# Altium schematic sheet NB_IoT.SchDoc
size A4
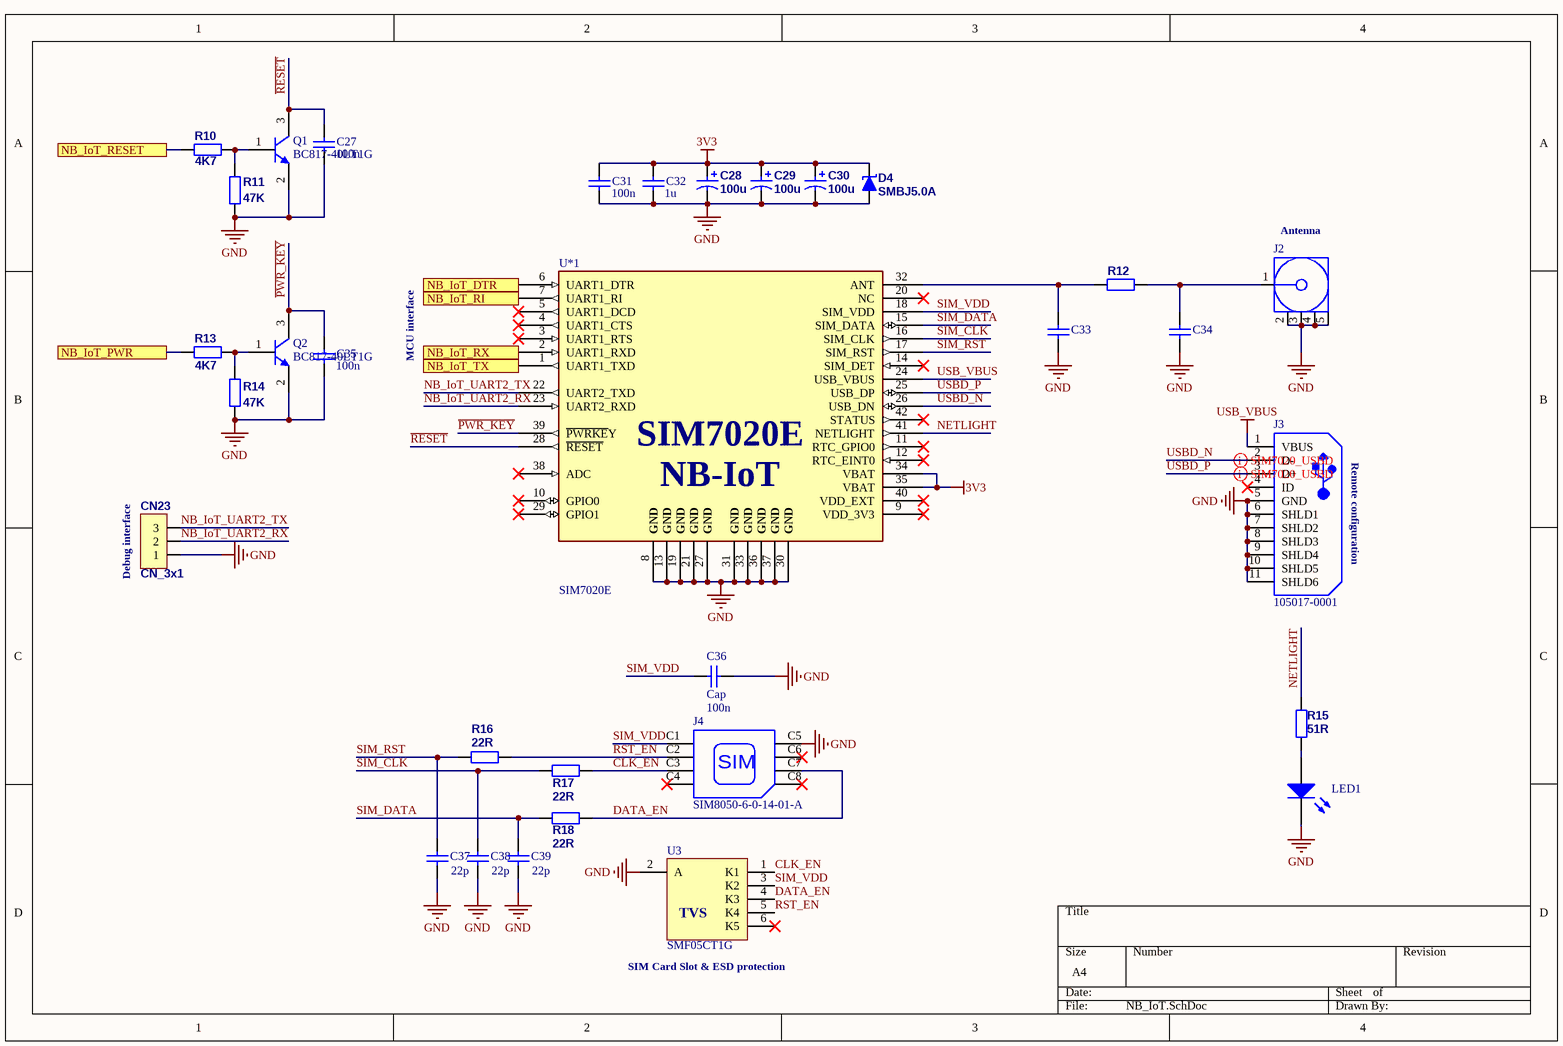
[diagram p0: NB_IoT.SchDoc]

## Parts
C27  value 100n  [0603_CAP_NPOL]  (hidden comment: Cap)
C28  100u  [0603_CAP_NPOL]
C29  100u  [0603_CAP_NPOL]
C30  100u  [0603_CAP_NPOL]
C31  value 100n  [0603_CAP_NPOL]  (hidden comment: Cap)
C32  value 1u  [0603_CAP_NPOL]  (hidden comment: Cap)
C33  ap  [0603_CAP_NPOL]  (value not drawn)
C34  ap  [0603_CAP_NPOL]  (value not drawn)
C35  value 100n  [0603_CAP_NPOL]  (hidden comment: Cap)
C36  Cap  value 100n  [0603_CAP_NPOL]
C37  value 22p  [0603_CAP_NPOL]  (hidden comment: Cap)
C38  value 22p  [0603_CAP_NPOL]  (hidden comment: Cap)
C39  value 22p  [0603_CAP_NPOL]  (hidden comment: Cap)
CN23  CN_3x1  [GP_3x1_2mm]
D4  SMBJ5.0A  [SMB]
J2  731000114  [MOLX-731000114_V]  (value not drawn)
J3  105017-0001  [USB-MICRO-B_V]
J4  SIM8050-6-0-14-01-A  [GCT-SIM8050-6_V]
LED1  150080RS75000  [0805_A]  (value not drawn)
Q1  BC817-40LT1G  [ONSC-SOT-23-3-318-08_V]
Q2  BC817-40LT1G  [ONSC-SOT-23-3-318-08_V]
R10  4K7  [0402_RES]
R11  47K  [0402_RES]
R12  (no value)  [0402_RES]
R13  4K7  [0402_RES]
R14  47K  [0402_RES]
R15  51R  [0402_RES]
R16  22R  [0402_RES]
R17  22R  [0402_RES]
R18  22R  [0402_RES]
U3  SMF05CT1G  [ONSC-SC70-6-419B-02_W_V]
U*1  SIM7020E  [LCC_42PIN]

## Ports
NB_IoT_DTR, NB_IoT_PWR, NB_IoT_RESET, NB_IoT_RI, NB_IoT_RX, NB_IoT_TX

## Nets
3V3: C28.1 C29.1 C30.1 C31.2 C32.2 D4.2(K) U*1.34(VBAT) U*1.35(VBAT)
GND: C27.1 C28.2 C29.2 C30.2 C31.1 C32.1 C33.1 C34.1 C35.1 C36.2 C37.1 C38.1 C39.1 CN23.1 D4.1(A) J2.2 J2.3 J2.4 J2.5 J3.5(GND) J3.6(SHLD1) J3.7(SHLD2) J3.8(SHLD3) J3.9(SHLD4) J3.10(SHLD5) J3.11(SHLD6) J4.C5(GND) LED1.1(K) Q1.2(E) Q2.2(E) R11.1 R14.1 U3.2(A) U*1.8(GND) U*1.13(GND) U*1.19(GND) U*1.21(GND) U*1.27(GND) U*1.30(GND) U*1.31(GND) U*1.33(GND) U*1.36(GND) U*1.37(GND)
USB_VBUS: J3.1(VBUS) U*1.24(USB_VBUS)
~{PWR_KEY}: C35.2 Q2.3(C) U*1.39(~{PWRKE}Y)
~{RESET}: C27.2 Q1.3(C) U*1.28(~{RESET})
CLK_EN: J4.C3(CLK) R17.2 U3.1(K1)
DATA_EN: J4.C7(I/O) R18.2 U3.4(K3)
NB_IoT_DTR: U*1.6(UART1_DTR) ; port NB_IoT_DTR
NB_IoT_PWR: R13.1 ; port NB_IoT_PWR
NB_IoT_RESET: R10.1 ; port NB_IoT_RESET
NB_IoT_RI: U*1.7(UART1_RI) ; port NB_IoT_RI
NB_IoT_RX: U*1.2(UART1_RXD) ; port NB_IoT_RX
NB_IoT_TX: U*1.1(UART1_TXD) ; port NB_IoT_TX
NB_IoT_UART2_RX: CN23.2 U*1.23(UART2_RXD)
NB_IoT_UART2_TX: CN23.3 U*1.22(UART2_TXD)
NETLIGHT: R15.2 U*1.41(NETLIGHT)
RST_EN: J4.C2(RST) R16.2 U3.5(K4)
SIM_CLK: C38.2 R17.1 U*1.16(SIM_CLK)
SIM_DATA: C39.2 R18.1 U*1.15(SIM_DATA)
SIM_RST: C37.2 R16.1 U*1.17(SIM_RST)
SIM_VDD: C36.1 J4.C1(VCC) U3.3(K2) U*1.18(SIM_VDD)
USBD_N: J3.2(D-) U*1.26(USB_DN)
USBD_P: J3.3(D+) U*1.25(USB_DP)
NetC33_2: C33.2 R12.1 U*1.32(ANT)
NetC34_2: C34.2 J2.1 R12.2
NetLED1_2: LED1.2(A) R15.1
NetQ1_1: Q1.1(B) R10.2 R11.2
NetQ2_1: Q2.1(B) R13.2 R14.2

Not connected (* = marked no-connect by the designer): J3 4(ID)*; J4 C4(SHLD)* C6(VPP)* C8(SHLD)*; U3 6(K5)*; U*1 3(UART1_RTS)* 4(UART1_CTS)* 5(UART1_DCD)* 9(VDD_3V3)* 10(GPIO0)* 11(RTC_GPIO0)* 12(RTC_EINT0)* 14(SIM_DET)* 20(NC)* 29(GPIO1)* 38(ADC)* 40(VDD_EXT)* 42(STATUS)*

## Layout directives
differential pair: USBD_N, USBD_P

## Notes on the sheet
- (near J2) Antenna
- MCU interface
- Remote configuration
- (near CN23) Debug interface
- (near U3) TVS
- (near U3) SIM Card Slot & ESD protection
- (in symbol CMP-2000-07068-1) SIM
- (in symbol SIM7020E) NB-IoT

## Library data of the parts
C27 C31-C39 = Cap: Capacitor; Published: 8-Jun-2000; LatestRevisionDate: 17-Jul-2002; LatestRevisionNote: Re-released for DXP Platform.; PackageReference: RAD-0.3; Publisher: Altium Limited; PackageDescription: Radial Cap, Thru-Hole; 2 Leads; 0.3 in Pin Spacing
C28-C30 = Cap Pol: Polarized Capacitor; ComponentLink1Description: datasheet; ComponentLink2Description: supplier; Value: 100u
D4 = SMBJ5.0A: 5.0V, 600W Surface Mount Transient Voltage Suppression Diode, SMBJ Series; Supplier 1: Farnell; Supplier 2: Farnell; Supplier 3: Farnell; Supplier 4: Farnell; Supplier 5: Farnell; Supplier 6: Farnell; Supplier 7: Farnell; Supplier 8: Farnell; Supplier 9: Farnell; Supplier 10: Farnell; Supplier 11: TME; Supplier 12: TME; Supplier 13: TME; Supplier Part Number 1: 9381554; Supplier Part Number 2: 1797897; Supplier Part Number 3: 9886311; Supplier Part Number 4: 2097845; Supplier Part Number 5: 1456972; Supplier Part Number 6: 7277792; Supplier Part Number 7: 9551107; Supplier Part Number 8: 2429079; Supplier Part Number 9: 2353654; Supplier Part Number 10: 2252493; Supplier Part Number 11: SMBJ5.0A-E3/52; Supplier Part Number 12: SMBJ5.0A-LF; Supplier Part Number 13: SMBJ5.0A-TR
J2 = CMP-2000-05487-1: SMA Right-Angle PCB Jack Receptacle, Brass Body, Gold Plated, 50 Ohm, 5-Pin THD, RoHS, Tray; Manufacturer: Molex; Datasheet Version: 09/2016; Package Description: 5-Pin Through Hole Device, Body 14.8 x 6.35 mm, Pitch 2.54 mm; Datasheet URL: http://www.molex.com/webdocs/datasheets/pdf/en-us/0731000114_RF_COAX_CONNECTORS.pdf; Manufacturer URL: http://www.molex.com/; Package Reference: 731000114; Mounting Technology: ThroughHole; Package URL: http://www.molex.com/pdm_docs/sd/731000114_sd.pdf
J3 = CMP-2000-05827-1: Micro-USB B Receptacle, Right Angle, Bottom Mount, Surface Mount, with Solder Tabs, -30 to 85 degC, 5-Pin USB, RoHS, Tape and Reel; Manufacturer: Molex; Featured Product: Micro-USBConnectorsUSBConnectors; Other Names: WM1399DKR; Package Version: Rev. F, 12/2012; Number of Contacts: 5; Connector Type: USB-microB; Catalog Drawings: 1050170001; 3D Model: 105017-0001.stp; Mating Products: WM17145-ND-CABLEMICROUSBBTOSTDA1.0MWM17147-ND-CABLEMICROUSBBTOSTDA2.0MWM17146-ND-CABLEMICROUSBBTOSTDA1.5M; PCN Assembly/Origin: ResinSupplier21/Oct/2015; Voltage - Max: 30V; Online Catalog: Molex-MicroUSB; Manufacturer URL: http://www.molex.com/; Package Description: 5-Leads USB, Micro B, Body 7.5 x 5 mm, Pitch 0.65 mm; Datasheet URL: http://www.molex.com/elqNow/elqRedir.htm?ref=http://www.molex.com/webdocs/datasheets/pdf/en-us/1050170001_IO_CONNECTORS.pdf; Ingress Protection: -; Datasheet Version: 03/2016; Mounting Type: BoardCutout,SurfaceMount,RightAngle; Circuits: 5; Standard Package: 1; Package Reference: MICRO-B; Package URL: http://www.molex.com/pdm_docs/sd/1050170001_sd.pdf; Category: Connectors,Interconnects; Series: -; RoHS Information: 1050170001CertofCompliance; Features: Shielded,SolderRetention; Family: USB,DVI,HDMIConnectors; Specifications: -; Gender: Receptacle; Packaging: Digi-Reel®; Mounting Technology: SurfaceMount
J4 = CMP-2000-07068-1: Nano SIM Card Connect Push-Pull Type, Profile Height 1.35 mm, 30 V Max, 0.5 A Max, -40 to 85 degC, 6-Pin SMT, RoHS, Tape and Reel; Manufacturer: Global Connector Technology; Pitch: 1.45mm; No of Positions: 6; Style/Orientation: Receptacle; Package Description: 6-Pin Surface Mount Device, Body 12.2 x 9.54 mm, Pitch 2.54 mm; Manufacturer URL: http://gct.co/; Datasheet Version: Rev. E, 09/2015; Datasheet URL: http://gct.co/sim-connectors/pdf/SIM8050.pdf; Type: Contact; Mounting Technology: SurfaceMount; Termination: PushPull; Package Reference: SIM8050-6-0-14-01-A
LED1 = CMP-1426-00011-1: SMD mono-color Chip LED, WL-SMCW, Red; Manufacturer: Wuerth Elektronik; Color: Red; PartNumber: 150080RS75000; PackageReference: 0805_A; ComponentLink2Description: Datasheet; ComponentLink1URL: http://www.we-online.com; ComponentLink1Description: Manufacturer URL; ComponentLink2URL: http://katalog.we-online.com/led/datasheet/150080RS75000.pdf
Q1 Q2 = CMP-1048-00019-1: General Purpose Transistor, NPN Silicon, 3-Pin SOT-23, Pb-Free, Tape and Reel; Manufacturer: On Semiconductor; fT Min (MHz): 100; IC Continuous (A): 0.5; ComponentLink2URL: http://www.onsemi.com/pub_link/Collateral/BC817-16LT1-D.PDF; DatasheetVersion: Rev. 12; ComponentLink3URL: http://www.onsemi.cn/pub_link/Collateral/318-08.PDF; ComponentLink3Description: Package Specification; ComponentLink1Description: Manufacturer URL; Mounting Technology: Surface Mount; ComponentLink1URL: http://www.onsemi.com/; Packing: Tape and Reel; ComponentLink2Description: Datasheet; Polarity: NPN; RoHS: TRUE; PackageVersion: Rev. AP, 11/2009; PartNumber: BC817-40LT1G; PackageDescription: 3-Pin Small Outline Transistor, Body 2.92 x 1.3 mm, Pitch 0.95 mm; PackageReference: SOT-23-3-318-08
R10-R18 = Res: Resistor; Published: 19-Feb-2006; ComponentLink1Description: datasheet; ComponentLink2Description: supplier
  R10 R13: Value: 4K7
  R11 R14: Value: 47K
  R15: Value: 51R
  R16-R18: Value: 22R
U3 = CMP-1061-00155-1: 5-Line Transient Voltage Suppressor Array, 6-Pin SC70, Pb-Free, Tape and Reel; Manufacturer: On Semiconductor; PPK Max (W): 100; Direction: Unidirectional; IR Max (uA): 5; PackageDescription: 6-Pin Small Outline Transistor, Body 2 x 1.25 mm, Pitch 0.65 mm; PackageReference: SC70-6-419B-02_W; ComponentLink2Description: Datasheet; Mounting Technology: Surface Mount; Packing: Tape and Reel; DatasheetVersion: Rev. 4; ComponentLink1Description: Manufacturer URL; ComponentLink2URL: http://www.onsemi.com/pub_link/Collateral/SMF05C-D.PDF; ComponentLink3Description: Package Specification; ComponentLink1URL: http://www.onsemi.com/; ComponentLink3URL: http://www.onsemi.com/pub_link/Collateral/SMF05C-D.PDF; PackageVersion: Rev. W; PartNumber: SMF05CT1G; RoHS: Pb-Free
U*1 = SIM7020E: Narrowband-IoT communication module; Control Via AT Commands; UART; SIM card (1.8V/3V) GPIO; ADC; Netlight; PSM_EINT; Reset; Powerkey; Supply voltage range: 2.1V-3.6V;; ComponentLink1Description: Documentation; ComponentLink1URL: https://simcom.ee/documents/SIM7020/SIM7020%20Hardware%20Design_V1.02.pdf; ComponentLink2Description: Product site; ComponentLink2URL: https://simcom.ee/modules/iot/sim7020/